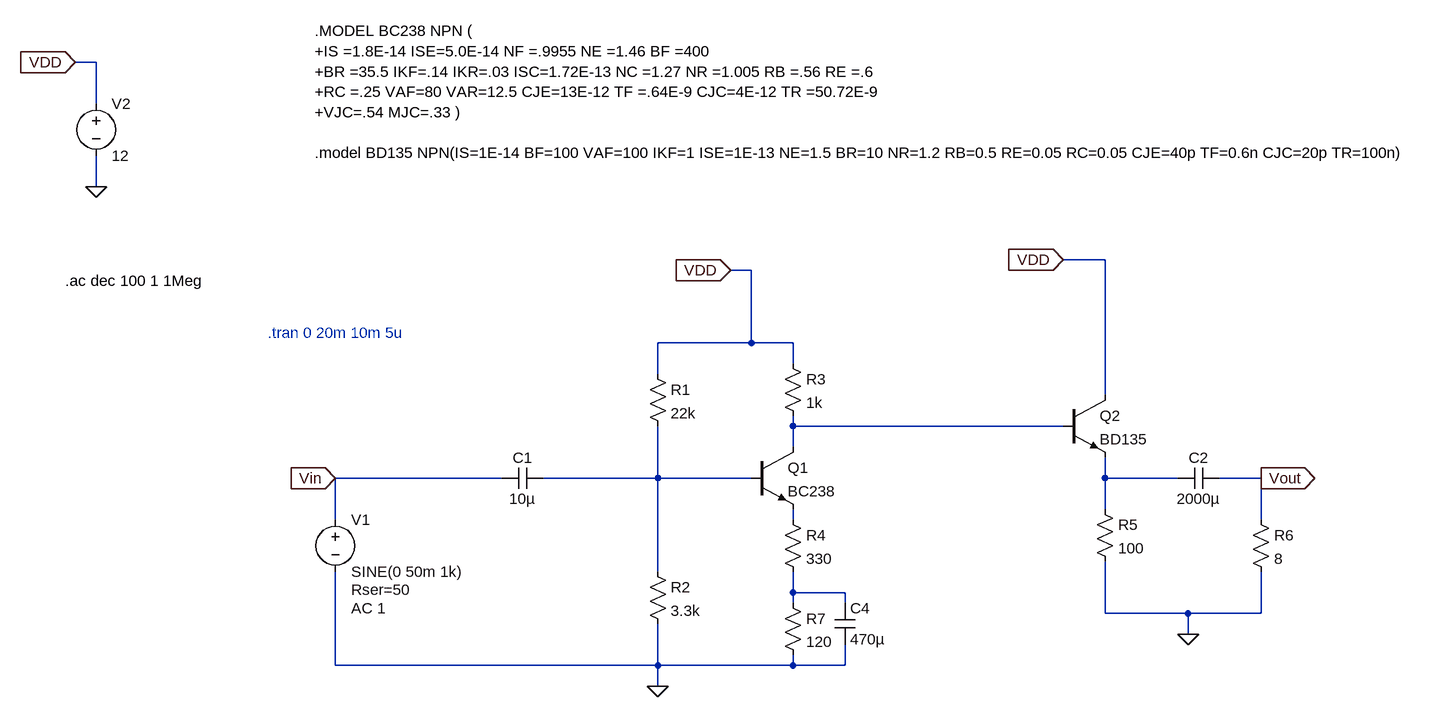
[diagram p0: schematic BJTAudio.asc]
BJTAudio.asc, the LTspice schematic file:
Version 4.1
SHEET 1 1568 680
WIRE -576 -544 -608 -544
WIRE -576 -480 -576 -544
WIRE -576 -352 -576 -400
WIRE 976 -240 912 -240
WIRE 432 -224 400 -224
WIRE 432 -112 432 -224
WIRE 432 -112 288 -112
WIRE 496 -112 432 -112
WIRE 496 -80 496 -112
WIRE 288 -64 288 -112
WIRE 976 -32 976 -240
WIRE 496 16 496 0
WIRE 912 16 496 16
WIRE 496 48 496 16
WIRE 48 96 -208 96
WIRE 288 96 288 16
WIRE 288 96 112 96
WIRE 432 96 288 96
WIRE 976 96 976 64
WIRE 1088 96 976 96
WIRE 1216 96 1152 96
WIRE 976 144 976 96
WIRE -208 160 -208 96
WIRE 496 160 496 144
WIRE 1216 160 1216 96
WIRE 288 240 288 96
WIRE 496 272 496 240
WIRE 576 272 496 272
WIRE 496 288 496 272
WIRE 576 288 576 272
WIRE 976 304 976 224
WIRE 1104 304 976 304
WIRE 1216 304 1216 240
WIRE 1216 304 1104 304
WIRE 1104 336 1104 304
WIRE -208 384 -208 240
WIRE 288 384 288 320
WIRE 288 384 -208 384
WIRE 496 384 496 368
WIRE 496 384 288 384
WIRE 576 384 576 352
WIRE 576 384 496 384
WIRE 288 416 288 384
FLAG 400 -224 VDD
IOPIN 400 -224 In
FLAG -208 96 Vin
IOPIN -208 96 In
FLAG 1216 96 Vout
IOPIN 1216 96 Out
FLAG 912 -240 VDD
IOPIN 912 -240 In
FLAG 288 416 0
FLAG 1104 336 0
FLAG -608 -544 VDD
IOPIN -608 -544 In
FLAG -576 -352 0
SYMBOL res 272 -80 R0
SYMATTR InstName R1
SYMATTR Value 22k
SYMBOL res 272 224 R0
SYMATTR InstName R2
SYMATTR Value 3.3k
SYMBOL res 480 -96 R0
SYMATTR InstName R3
SYMATTR Value 1k
SYMBOL npn 432 48 R0
SYMATTR InstName Q1
SYMATTR Value BC238
SYMBOL npn 912 -32 R0
SYMATTR InstName Q2
SYMATTR Value BD135
SYMBOL cap 112 80 R90
WINDOW 0 0 32 VBottom 2
WINDOW 3 32 32 VTop 2
SYMATTR InstName C1
SYMATTR Value 10µ
SYMBOL res 960 128 R0
SYMATTR InstName R5
SYMATTR Value 100
SYMBOL res 1200 144 R0
SYMATTR InstName R6
SYMATTR Value 8
SYMBOL cap 1152 80 R90
WINDOW 0 0 32 VBottom 2
WINDOW 3 32 32 VTop 2
SYMATTR InstName C2
SYMATTR Value 2000µ
SYMBOL voltage -208 144 R0
WINDOW 123 24 152 Left 2
WINDOW 39 24 124 Left 2
SYMATTR InstName V1
SYMATTR Value SINE(0 50m 1k)
SYMATTR Value2 AC 1
SYMATTR SpiceLine Rser=50
SYMBOL voltage -576 -496 R0
WINDOW 123 0 0 Left 0
WINDOW 39 0 0 Left 0
SYMATTR InstName V2
SYMATTR Value 12
SYMBOL res 480 144 R0
SYMATTR InstName R4
SYMATTR Value 330
SYMBOL res 480 272 R0
SYMATTR InstName R7
SYMATTR Value 120
SYMBOL cap 560 288 R0
SYMATTR InstName C4
SYMATTR Value 470µ
TEXT -240 -592 Left 2 !.MODEL BC238 NPN (\n+IS =1.8E-14 ISE=5.0E-14 NF =.9955 NE =1.46 BF =400\n+BR =35.5 IKF=.14 IKR=.03 ISC=1.72E-13 NC =1.27 NR =1.005 RB =.56 RE =.6\n+RC =.25 VAF=80 VAR=12.5 CJE=13E-12 TF =.64E-9 CJC=4E-12 TR =50.72E-9\n+VJC=.54 MJC=.33 )\n \n.model BD135 NPN(IS=1E-14 BF=100 VAF=100 IKF=1 ISE=1E-13 NE=1.5 BR=10 NR=1.2 RB=0.5 RE=0.05 RC=0.05 CJE=40p TF=0.6n CJC=20p TR=100n)
TEXT -312 -128 Left 2 ;.tran 0 20m 10m 5u
TEXT -624 -208 Left 2 !.ac dec 100 1 1Meg

The netlist it stands for:
* BJTAudio.asc
R1 VDD N002 22k
R2 N002 0 3.3k
R3 VDD N001 1k
Q1 N001 N002 N004 0 BC238
Q2 VDD N001 N003 0 BD135
C1 N002 Vin 10µ
R5 N003 0 100
R6 Vout 0 8
C2 Vout N003 2000µ
V1 Vin 0 SINE(0 50m 1k) AC 1 Rser=50
V2 VDD 0 12
R4 N004 N005 330
R7 N005 0 120
C4 N005 0 470µ
.model NPN NPN
.model PNP PNP
.lib standard.bjt
.MODEL BC238 NPN (
+IS =1.8E-14 ISE=5.0E-14 NF =.9955 NE =1.46 BF =400
+BR =35.5 IKF=.14 IKR=.03 ISC=1.72E-13 NC =1.27 NR =1.005 RB =.56 RE =.6
+RC =.25 VAF=80 VAR=12.5 CJE=13E-12 TF =.64E-9 CJC=4E-12 TR =50.72E-9
+VJC=.54 MJC=.33 )
.model BD135 NPN(IS=1E-14 BF=100 VAF=100 IKF=1 ISE=1E-13 NE=1.5 BR=10 NR=1.2 RB=0.5 RE=0.05 RC=0.05 CJE=40p TF=0.6n CJC=20p TR=100n)
* .tran 0 20m 10m 5u
.ac dec 100 1 1Meg
.backanno
.end